# EAGLE design urbieBoard (EAGLE 7.1.0)
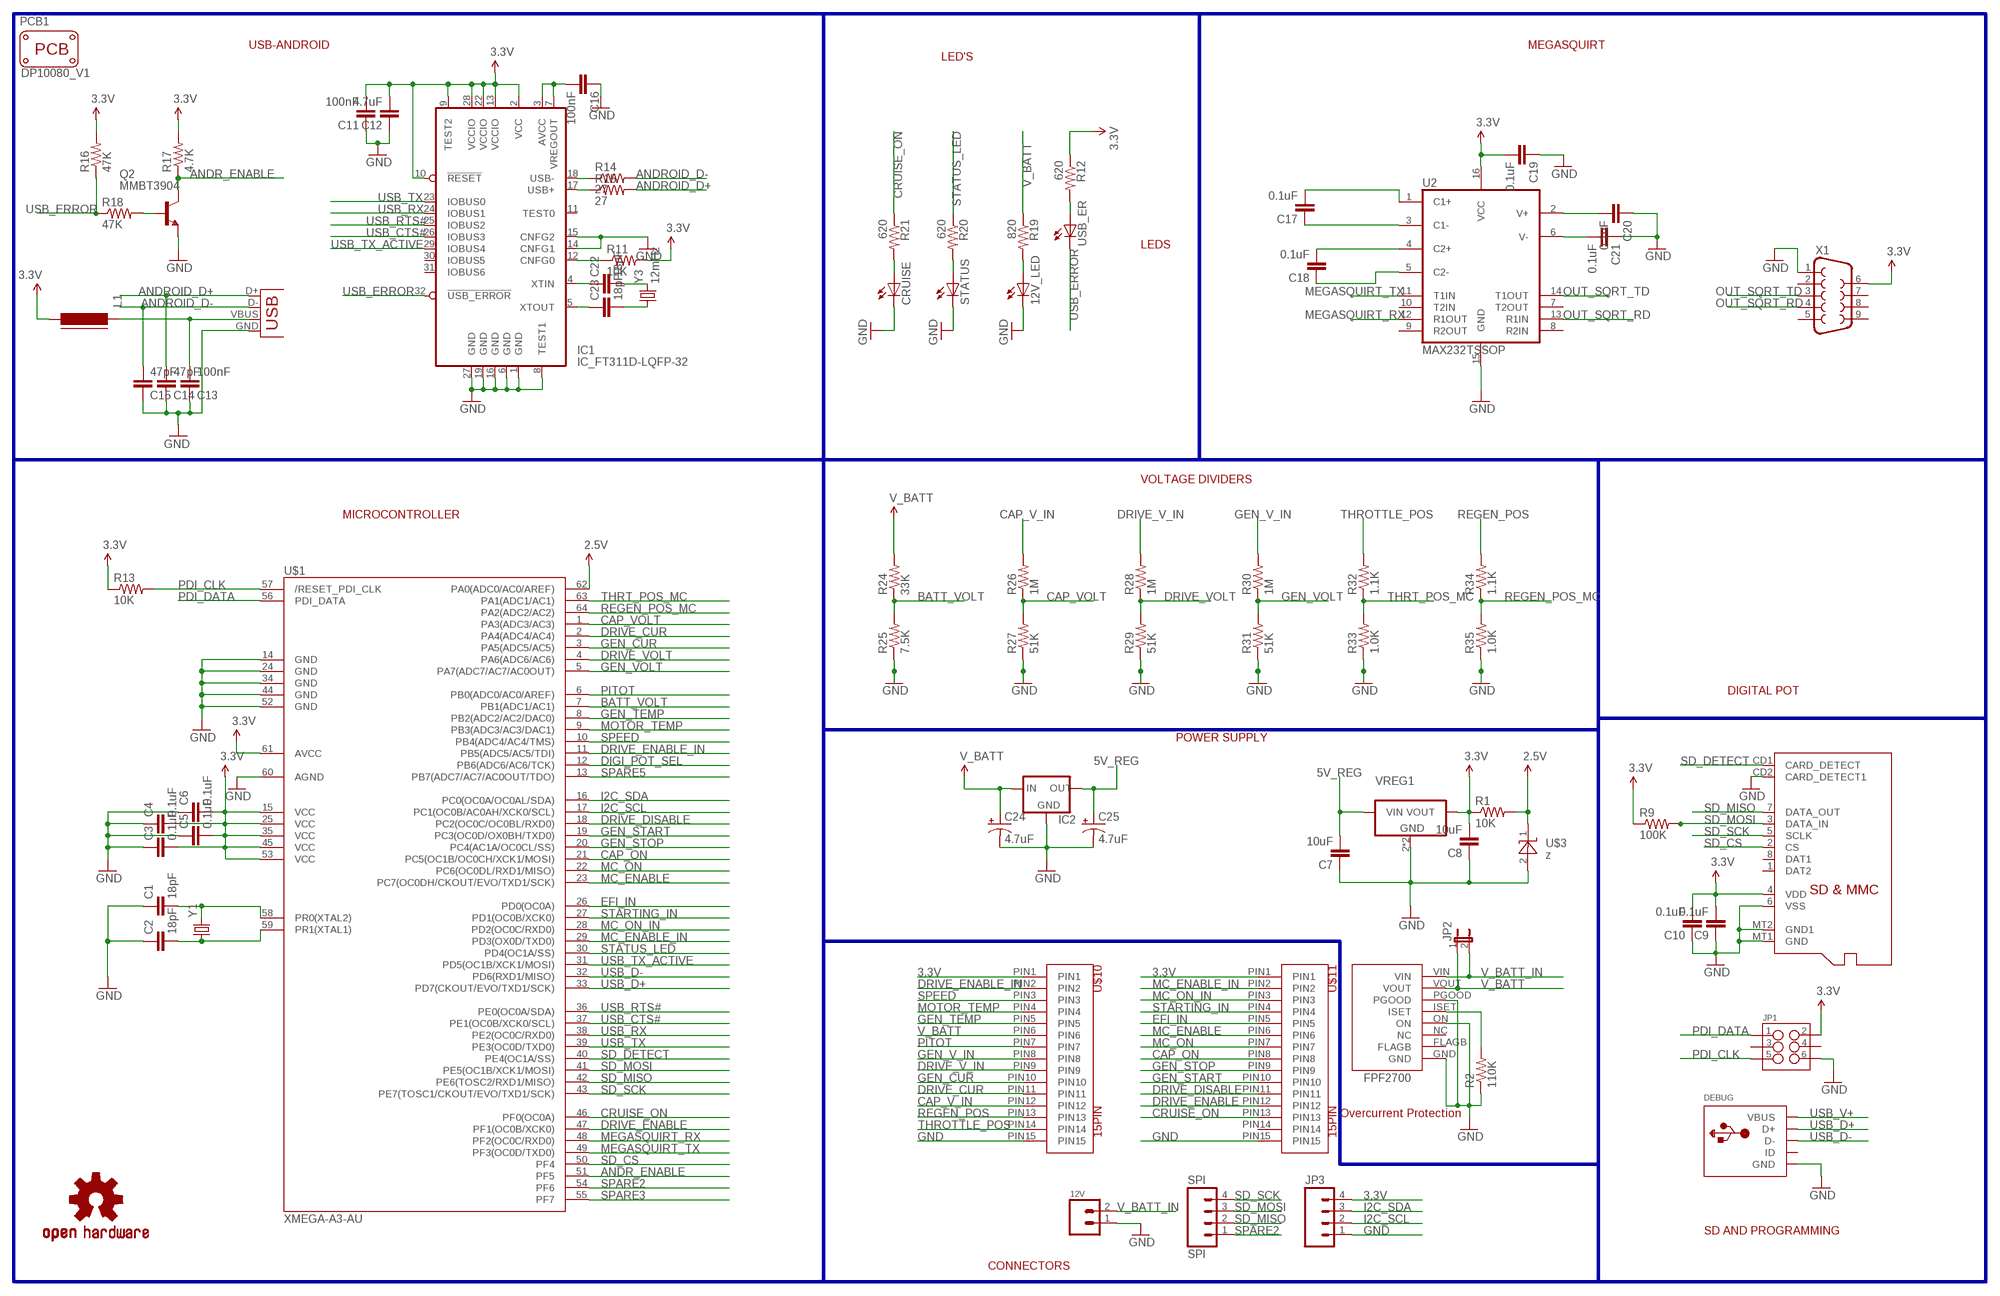
[diagram p0: schematic, sheet 1]

## Parts
12V  DURACLIK-2SMD  [DURACLIK-2]
12V_LED  LEDCHIP-LED0603  [CHIP-LED0603]
C1  18pF  CAP0603-CAP  [0603-CAP]
C2  18pF  CAP0603-CAP  [0603-CAP]
C3  0.1uF  CAP0603-CAP  [0603-CAP]
C4  0.1uF  CAP0603-CAP  [0603-CAP]
C5  0.1uF  CAP0603-CAP  [0603-CAP]
C6  0.1uF  CAP0603-CAP  [0603-CAP]
C7  10uF  CAP0603-CAP  [0603-CAP]
C8  10uF  CAP0603-CAP  [0603-CAP]
C9  0.1uF  CAP0603-CAP  [0603-CAP]
C10  0.1uF  CAP0603-CAP  [0603-CAP]
C11  100nF  CAP0603-CAP  [0603-CAP]
C12  4.7uF  CAP0603-CAP  [0603-CAP]
C13  100nF  CAP0603-CAP  [0603-CAP]
C14  47pF  CAP0603-CAP  [0603-CAP]
C15  47pF  CAP0603-CAP  [0603-CAP]
C16  100nF  CAP0603-CAP  [0603-CAP]
C17  0.1uF  CAP0603-CAP  [0603-CAP]
C18  0.1uF  CAP0603-CAP  [0603-CAP]
C19  0.1uF  CAP0603-CAP  [0603-CAP]
C20  0.1uF  CAP0603-CAP  [0603-CAP]
C21  0.1uF  CAP0603-CAP  [0603-CAP]
C22  18pF  CAP0603-CAP  [0603-CAP]
C23  18pF  CAP0603-CAP  [0603-CAP]
C24  4.7uF  CAP_POLPTH2  [CPOL-RADIAL-10UF-25V]
C25  4.7uF  CAP_POLPTH2  [CPOL-RADIAL-10UF-25V]
CRUISE  LEDCHIP-LED0603  [CHIP-LED0603]
DEBUG  USBMINIB  [USB-MINIB]
IC1  IC_FT311D-LQFP-32  [LQFP-32]
IC2  V_REG_78XXSINK  [TO220-IGO]
JP1  M03X22X3_SILK_SM  [2X3]
JP2  JP1E  [JP1]
JP3  M04POLAR_LOCK  [MOLEX-1X4_LOCK]
JP4  USB-A-S  [USB-A-S]
L1  FERRITE-0805  [FB805]
LOGO1  OSHW-LOGOM  [OSHW-LOGO-M]
PCB1  PCB_DP_RECTANGLE-80X100  [DP10080_V1]
Q2  MMBT3904  BCX20SMD  [SOT23-BEC]
R1  10K  RESISTOR0603-RES  [0603-RES]
R2  110K  RESISTOR0603-RES  [0603-RES]
R9  100K  RESISTOR0603-RES  [0603-RES]
R11  10K  RESISTOR0603-RES  [0603-RES]
R12  620  RESISTOR0603-RES  [0603-RES]
R13  10K  RESISTOR0603-RES  [0603-RES]
R14  27  RESISTOR0603-RES  [0603-RES]
R15  27  RESISTOR0603-RES  [0603-RES]
R16  47K  RESISTOR0603-RES  [0603-RES]
R17  4.7K  RESISTOR0603-RES  [0603-RES]
R18  47K  RESISTOR0603-RES  [0603-RES]
R19  820  RESISTOR0603-RES  [0603-RES]
R20  620  RESISTOR0603-RES  [0603-RES]
R21  620  RESISTOR0603-RES  [0603-RES]
R24  33K  RESISTOR0603-RES  [0603-RES]
R25  7.5K  RESISTOR0603-RES  [0603-RES]
R26  1M  RESISTOR0603-RES  [0603-RES]
R27  51K  RESISTOR0603-RES  [0603-RES]
R28  1M  RESISTOR0603-RES  [0603-RES]
R29  51K  RESISTOR0603-RES  [0603-RES]
R30  1M  RESISTOR0603-RES  [0603-RES]
R31  51K  RESISTOR0603-RES  [0603-RES]
R32  1.1K  RESISTOR0603-RES  [0603-RES]
R33  1.0K  RESISTOR0603-RES  [0603-RES]
R34  1.1K  RESISTOR0603-RES  [0603-RES]
R35  1.0K  RESISTOR0603-RES  [0603-RES]
SPI  SPI  M04POLAR_LOCK  [MOLEX-1X4_LOCK]
STATUS  LEDCHIP-LED0603  [CHIP-LED0603]
U2  MAX232TSSOP  [TSSOP16]
U$1  XMEGA-A3-AU  [TQFP64_14X14MM]
U$2  MICROSD  [MICROSD]
U$3  z  LM4040CYM3-2.5  [SOT-23]
U$8  FPF2700  [FPF2700]
U$10  15PIN  [15PIN]
U$11  15PIN  [15PIN]
USB_ER  LEDCHIP-LED0603  [CHIP-LED0603]
VREG1  VREG_3PINS-SOT-223  [SOT-223]
X1  DB9MALE  [DB9_MALE]
Y1  CRYSTALTXC-7A  [CRYSTAL-TXC-7A]
Y3  12mHz  CRYSTALTXC-7A  [CRYSTAL-TXC-7A]

## Nets
2.8V: R1.2 U$1.62(PA0(ADC0/AC0/AREF)) U$3.1(C) ; supply symbol labelled 2.5V
3.3V: C3.2 C4.2 C5.2 C6.2 C8.2 C9.2 C10.2 C11.2 C12.2 C19.2 IC1.2(VCC) IC1.9(TEST2) IC1.10(!RESET) IC1.13(VCCIO) IC1.22(VCCIO) IC1.28(VCCIO) JP1.2 JP3.4 L1.2 R1.1 R9.1 R11.2 R12.1 R13.1 R16.2 R17.2 U2.16(VCC) U$1.15(VCC1) U$1.25(VCC2) U$1.35(VCC3) U$1.45(VCC4) U$1.53(VCC5) U$1.61(AVCC) U$2.4(VDD) U$10.PIN1 U$11.PIN1 VREG1.3(VOUT) X1.6
5V_REG: C7.2 C25.1(+) IC2.OUT VREG1.1(VIN)
ANDR_ENABLE: Q2.C R17.1 U$1.51(PF5)
ANDROID_D+: C14.2 JP4.D+ R15.2
ANDROID_D-: C15.2 JP4.D- R14.2
BATT_VOLT: R24.1 R25.2 U$1.7(PB1(ADC1/AC1))
CAP_ON: U$1.21(PC5(OC1B/OC0CH/XCK1/MOSI)) U$11.PIN8
CAP_V_IN: R26.2 U$10.PIN12
CAP_VOLT: R26.1 R27.2 U$1.1(PA3(ADC3/AC3))
CRUISE_ON: R21.1 U$1.46(PF0(OC0A)) U$11.PIN13
DIGI_POT_SEL: U$1.12(PB6(ADC6/AC6/TCK))
DRIVE_CUR: U$1.2(PA4(ADC4/AC4)) U$10.PIN11
DRIVE_DISABLE: U$1.18(PC2(OC0C/OC0BL/RXD0)) U$11.PIN11
DRIVE_ENABLE: U$1.47(PF1(OC0B/XCK0)) U$11.PIN12
DRIVE_ENABLE_IN: U$1.11(PB5(ADC5/AC5/TDI)) U$10.PIN2
DRIVE_V_IN: R28.2 U$10.PIN9
DRIVE_VOLT: R28.1 R29.2 U$1.4(PA6(ADC6/AC6))
EFI_IN: U$1.26(PD0(OC0A)) U$11.PIN5
GEN_CUR: U$1.3(PA5(ADC5/AC5)) U$10.PIN10
GEN_START: U$1.19(PC3(OC0D/OX0BH/TXD0)) U$11.PIN10
GEN_STOP: U$1.20(PC4(AC1A/OC0CL/SS)) U$11.PIN9
GEN_TEMP: U$1.8(PB2(ADC2/AC2/DAC0)) U$10.PIN5
GEN_V_IN: R30.2 U$10.PIN8
GEN_VOLT: R30.1 R31.2 U$1.5(PA7(ADC7/AC7/AC0OUT))
GND: 12V.1(PIN1) 12V_LED.C C1.1 C2.1 C3.1 C4.1 C5.1 C6.1 C7.1 C8.1 C9.1 C10.1 C11.1 C12.1 C13.1 C14.1 C15.1 C16.1 C19.1 C20.1 C21.1 C24.2(-) C25.2(-) CRUISE.C DEBUG.GND IC1.1(GND) IC1.6(GND) IC1.8(TEST1) IC1.14(CNFG1) IC1.15(CNFG2) IC1.16(GND) IC1.19(GND) IC1.27(GND) IC2.GND JP1.6 JP3.1 JP4.GND Q2.E R2.1 R25.1 R27.1 R29.1 R31.1 R33.1 R35.1 STATUS.C U2.15(GND) U$1.14(GND1) U$1.24(GND2) U$1.34(GND3) U$1.44(GND4) U$1.52(GND5) U$1.60(AGND) U$2.6(VSS) U$2.CD2(CARD_DETECT1) U$2.MT1(GND) U$2.MT2(GND1) U$3.2(A) U$8.GND U$8.ON U$8.PGOOD U$10.PIN15 U$11.PIN15 VREG1.2(GND) VREG1.4(GND) X1.1
I2C_SCL: JP3.2 U$1.17(PC1(OC0B/AC0AH/XCK0/SCL))
I2C_SDA: JP3.3 U$1.16(PC0(OC0A/OC0AL/SDA))
MC_ENABLE: U$1.23(PC7(OC0DH/CKOUT/EVO/TXD1/SCK)) U$11.PIN6
MC_ENABLE_IN: U$1.29(PD3(OX0D/TXD0)) U$11.PIN2
MC_ON: U$1.22(PC6(OC0DL/RXD1/MISO)) U$11.PIN7
MC_ON_IN: U$1.28(PD2(OC0C/RXD0)) U$11.PIN3
MEGASQUIRT_RX: U2.12(R1OUT) U$1.48(PF2(OC0C/RXD0))
MEGASQUIRT_TX: U2.11(T1IN) U$1.49(PF3(OC0D/TXD0))
MOTOR_TEMP: U$1.9(PB3(ADC3/AC3/DAC1)) U$10.PIN4
N$1: C1.2 U$1.58(PR0(XTAL2)) Y1.P$2
N$2: C2.2 U$1.59(PR1(XTAL1)) Y1.P$1
N$8: C22.1 IC1.4(XTIN)
N$9: C23.1 IC1.5(XTOUT)
N$10: R2.2 U$8.ISET
N$11: IC1.12(CNFG0) R11.1
N$12: C22.2 Y3.P$2
N$13: C23.2 Y3.P$1
N$15: IC1.18(USB-) R14.1
N$18: C17.2 U2.1(C1+)
N$19: IC1.17(USB+) R15.1
N$20: C16.2 IC1.3(AVCC) IC1.7(VREGOUT)
N$23: Q2.B R18.2
N$24: C13.2 JP4.VBUS L1.1
N$25: C17.1 U2.3(C1-)
N$26: C18.2 U2.4(C2+)
N$27: C18.1 U2.5(C2-)
N$28: C21.2 U2.6(V-)
N$29: C20.2 U2.2(V+)
N$30: R12.2 USB_ER.A
N$31: 12V_LED.A R19.2
N$33: CRUISE.A R21.2
N$35: R20.2 STATUS.A
OUT_SQRT_RD: U2.13(R1IN) X1.4
OUT_SQRT_TD: U2.14(T1OUT) X1.3
PDI_CLK: JP1.5 R13.2 U$1.57(/RESET_PDI_CLK)
PDI_DATA: JP1.1 U$1.56(PDI_DATA)
PITOT: U$1.6(PB0(ADC0/AC0/AREF)) U$10.PIN7
REGEN_POS: R34.2 U$10.PIN13
REGEN_POS_MC: R34.1 R35.2 U$1.64(PA2(ADC2/AC2))
SD_CS: U$1.50(PF4) U$2.2(CS)
SD_DETECT: U$1.40(PE4(OC1A/SS)) U$2.CD1(CARD_DETECT)
SD_MISO: SPI.2 U$1.42(PE6(TOSC2/RXD1/MISO)) U$2.7(DATA_OUT)
SD_MOSI: R9.2 SPI.3 U$1.41(PE5(OC1B/XCK1/MOSI)) U$2.3(DATA_IN)
SD_SCK: SPI.4 U$1.43(PE7(TOSC1/CKOUT/EVO/TXD1/SCK)) U$2.5(SCLK)
SPARE2: SPI.1 U$1.54(PF6)
SPARE3: U$1.55(PF7)
SPARE5: U$1.13(PB7(ADC7/AC7/AC0OUT/TDO))
SPEED: U$1.10(PB4(ADC4/AC4/TMS)) U$10.PIN3
STARTING_IN: U$1.27(PD1(OC0B/XCK0)) U$11.PIN4
STATUS_LED: R20.1 U$1.30(PD4(OC1A/SS))
THROTTLE_POS: R32.2 U$10.PIN14
THRT_POS_MC: R32.1 R33.2 U$1.63(PA1(ADC1/AC1))
USB_CTS#: IC1.26(IOBUS3) U$1.37(PE1(OC0B/XCK0/SCL))
USB_D+: DEBUG.D+ U$1.33(PD7(CKOUT/EVO/TXD1/SCK))
USB_D-: DEBUG.D- U$1.32(PD6(RXD1/MISO))
USB_ERROR: IC1.32(!USB_ERROR) R16.1 R18.1 USB_ER.C
USB_RTS#: IC1.25(IOBUS2) U$1.36(PE0(OC0A/SDA))
USB_RX: IC1.24(IOBUS1) U$1.38(PE2(OC0C/RXD0))
USB_TX: IC1.23(IOBUS0) U$1.39(PE3(OC0D/TXD0))
USB_TX_ACTIVE: IC1.29(IOBUS4) U$1.31(PD5(OC1B/XCK1/MOSI))
USB_V+: DEBUG.VBUS
V_BATT: C24.1(+) IC2.IN JP2.1 R19.1 R24.2 U$8.VOUT U$10.PIN6
V_BATT_IN: 12V.2(PIN2) JP2.2 U$8.VIN
Unconnected: DEBUG.ID IC1.11(TEST0) IC1.30(IOBUS5) IC1.31(IOBUS6) JP1.3 JP1.4 U2.7(T2OUT) U2.8(R2IN) U2.9(R2OUT) U2.10(T2IN) U$2.1(DAT2) U$2.8(DAT1) U$8.FLAGB U$8.NC U$11.PIN14 X1.2 X1.5 X1.7 X1.8 X1.9

## Buses
B$1

## Notes on the sheet
- USB-ANDROID | MEGASQUIRT
- LED'S
- LEDS
- VOLTAGE DIVIDERS
- MICROCONTROLLER
- DIGITAL POT
- POWER SUPPLY
- Overcurrent Protection
- SD AND PROGRAMMING
- CONNECTORS

## Library data of the parts
12V = Senior Design:DURACLIK-2: Device for 2 circuit Molex DuraClik 2.00mm Pitch Wire-to-Board Connector System; OC_NEWARK: unknown
12V_LED CRUISE STATUS USB_ER = adafruit:LED: LED OSRAM: - CHIPLED LG R971, LG N971, LY N971, LG Q971, LY Q971, LO R971, LY R971 LH N974, LH R974 LS Q976, LO Q976, LY Q976 LO Q996 - Hyper CHIPLED LW Q18S LB Q993, LB Q99A, LB R99A - SideLED LS A670, LO A670, LY A670, LG A670, LP A670 LB A673, LV A673, LT A673, LW A673 LH A674 LY A675 LS A676, LA A676, LO A676, LY A676, LW A676 LS A679, LY A679, LG A679 - Hyper Micro SIDELED® LS Y876, LA Y876, LO Y876, LY Y876 LT Y87S - SmartLED LW L88C, LW L88S LB L89C, LB L89S, LG L890 LS L89K, LO L89K, LY L89K LS L896, LA L896, LO L896, LY L896 - TOPLED LS T670, LO T670, LY T670, LG T670, LP T670 LSG T670, LSP T670, LSY T670, LOP T670, LYG T670 LG T671, LOG T671, LSG T671 LB T673, LV T673, LT T673, LW T673 LH T674 LS T676, LA T676, LO T676, LY T676, LB T676, LH T676, LSB T676, LW T676 LB T67C, LV T67C, LT T67C, LS T67K, LO T67K, LY T67K, LW E67C LS E67B, LA E67B, LO E67B, LY E67B, LB E67C, LV E67C, LT E67C LW T67C LS T679, LY T679, LG T679 LS T770, LO T770, LY T770, LG T770, LP T770 LB T773, LV T773, LT T773, LW T773 LH T774 LS E675, LA E675, LY E675, LS T675 LS T776, LA T776, LO T776, LY T776, LB T776 LHGB T686 LT T68C, LB T68C - Hyper Mini TOPLED® LB M676 - Mini TOPLED Santana® LG M470 LS M47K, LO M47K, LY M47K Source: http://www.osram.convergy.de/; OC_NEWARK: unknown
C1 C2 C22 C23 = SparkFun-Capacitors:CAP: Capacitor Standard 0603 ceramic capacitor, and 0.1" leaded capacitor.; MPN: 06031A180JAT2A; OC_NEWARK: 60R6182
C3-C21 = SparkFun-Capacitors:CAP: Capacitor Standard 0603 ceramic capacitor, and 0.1" leaded capacitor.; OC_NEWARK: unknown
C24 C25 = SparkFun-Passives:CAP_POL: Capacitor Polarized These are standard SMD and PTH capacitors. Normally 10uF, 47uF, and 100uF in electrolytic and tantalum varieties. Always verify the external diameter of the through hole cap, it varies with capacity, voltage, and manufacturer. The EIA devices should be standard.; OC_NEWARK: unknown
DEBUG = adafruit:USB: USB Connectors USBMINIB - Surface Mount Female Mini-B USB Connector 4UConnector: 06564 By microbuilder.eu Thru-hole RA Female Mini-B USB Connector 4UConnector: 18732 By ladyada.net; OC_NEWARK: unknown
IC1 = dp_devices:IC_FT311D: USB Android Host Mfr no: FT311D-32L1C FT311D <http://www.ftdichip.com/Support/Documents/DataSheets/ICs/DS_FT311D.pdf>; OC_NEWARK: unknown
IC2 = SparkFun-PowerIC:V_REG_78XX: Voltage Regulator Standard 7805 5V regulator. IGO (Input Ground Output). Spark Fun Electronics SKU : COM-00107; OC_NEWARK: unknown
JP1 = SparkFun-Connectors:M03X2: 2x3 .1" header. Shrouded, with keying- CONN-10681 SMT- CONN-11415 Pogo pins- HW-11044; OC_NEWARK: unknown
JP2 = jumper:JP1E: JUMPER; OC_NEWARK: unknown
JP3 SPI = SparkFun-Connectors:M04: Header 4 Standard 4-pin 0.1" header. Use with straight break away headers (SKU : PRT-00116), right angle break away headers (PRT-00553), swiss pins (PRT-00743), machine pins (PRT-00117), and female headers (PRT-00115). Molex polarized connector foot print use with SKU : PRT-08231 with associated crimp pins and housings. 1MM SMD Version SKU: PRT-10208; OC_NEWARK: unknown
JP4 = SparkFun-Connectors:USB: USB Connectors USB-B-PTH is fully proven SKU : PRT-00139/CONN-08278 USB-miniB is fully proven SKU : PRT-00587 USB-A-PCB is untested. USB-A-H is throughly reviewed, but untested. Spark Fun Electronics SKU : PRT-00437 USB-B-SMT is throughly reviewed, but untested. Needs silkscreen touching up. USB-A-S has not been used/tested USB-MB-H has not been used/tested USB-MICROB has been used. CONN-09505
L1 = dp_devices:FERRITE: Ferrite bead in various packages; OC_NEWARK: unknown
LOGO1 = SparkFun-Aesthetics:OSHW-LOGO: Open Source Hardware Logo This logo indicates the piece of hardware it is found on incorporates a OSHW license and/or adheres to the definition of open source hardware found here: http://freedomdefined.org/OSHW; OC_NEWARK: unknown
PCB1 = dp_devices:PCB_DP_RECTANGLE: Dangerous Prototypes Standard Rectangular PCB sizes; OC_NEWARK: unknown; PCB_SIZE: DP10080_V1
Q2 = transistor-npn:BCX20*: NPN Transistor; OC_NEWARK: unknown
R1 R2 R9 R11-R21 R24-R35 = SparkFun-Passives:RESISTOR: Resistor Basic schematic elements and footprints for 0603, 1206, and PTH resistors.; OC_NEWARK: unknown
U2 = SparkFun-DigitalIC:MAX232: RS232 Transceiver Very common IC. This is generically called 'MAX232', but works with the 3V equivalent MAX3232 generic ICs. Field tested and mother approved. Spark Fun Electronics SKU : COM-00316 (DIP) and COM-00589 (SMD); OC_NEWARK: unknown
U$1 = SparkFun-DigitalIC:XMEGA-A3: Atmel's 8/16-bit AVR XMEGA A3 Microcontroller - ATxmega256A3, etc.; OC_NEWARK: unknown
U$2 = adafruit:MICROSD: Micro-SD / Transflash card holder with SPI pinout For the 3M # 2908-05WB-MG and/or 4UCON #19656 push-push type; OC_NEWARK: unknown
U$3 = GuShH:LM4040; OC_NEWARK: unknown
U$8 = FPF2700:FPF2700; OC_NEWARK: unknown
U$10 U$11 = 15pinconn:15PIN
VREG1 = dp_devices:VREG_3PINS: Various 3 pin voltage regulators in different packages Double check the right pinout for the right part; OC_NEWARK: unknown
X1 = SparkFun-Connectors:DB9: DB9 Connector Standard DB9 (D-Sub 9) serial connector. Can be used for CAN bus as well as RS485 and RS232. Footprint production proven. Spark Fun Electronics SKU : PRT-00429; OC_NEWARK: unknown
Y1 Y3 = SparkFun-FreqCtrl:CRYSTAL: Various standard crystals. Proven footprints. Spark Fun Electronics SKU : COM-00534; OC_NEWARK: unknown

## Board
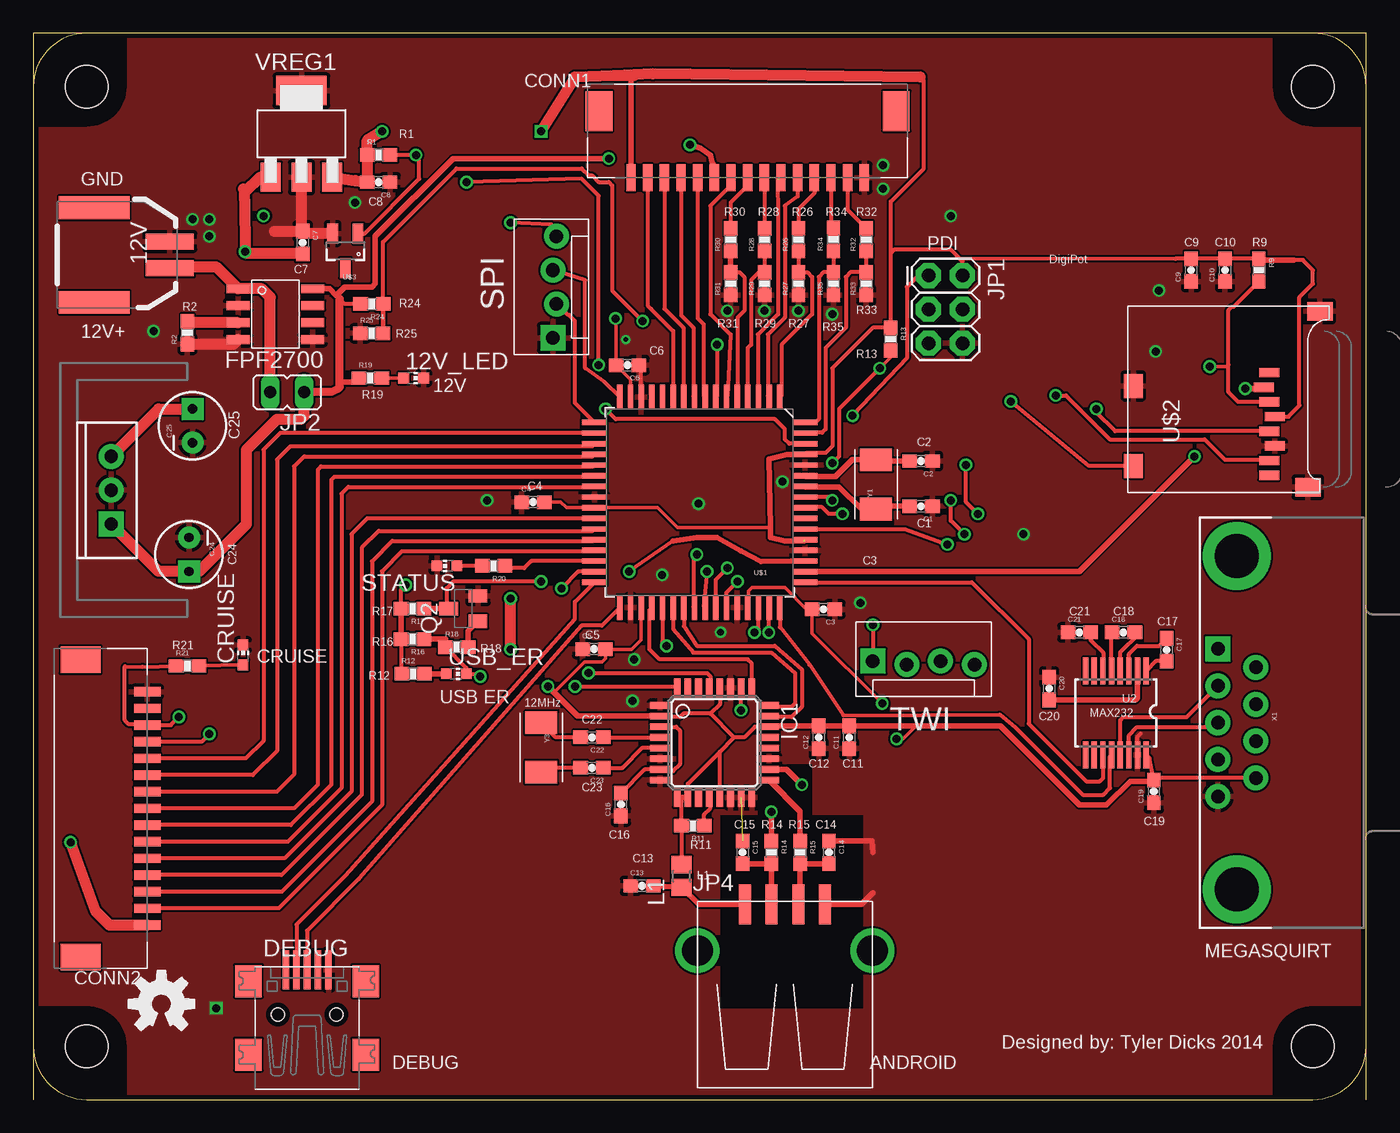
[diagram p1: board, top side]
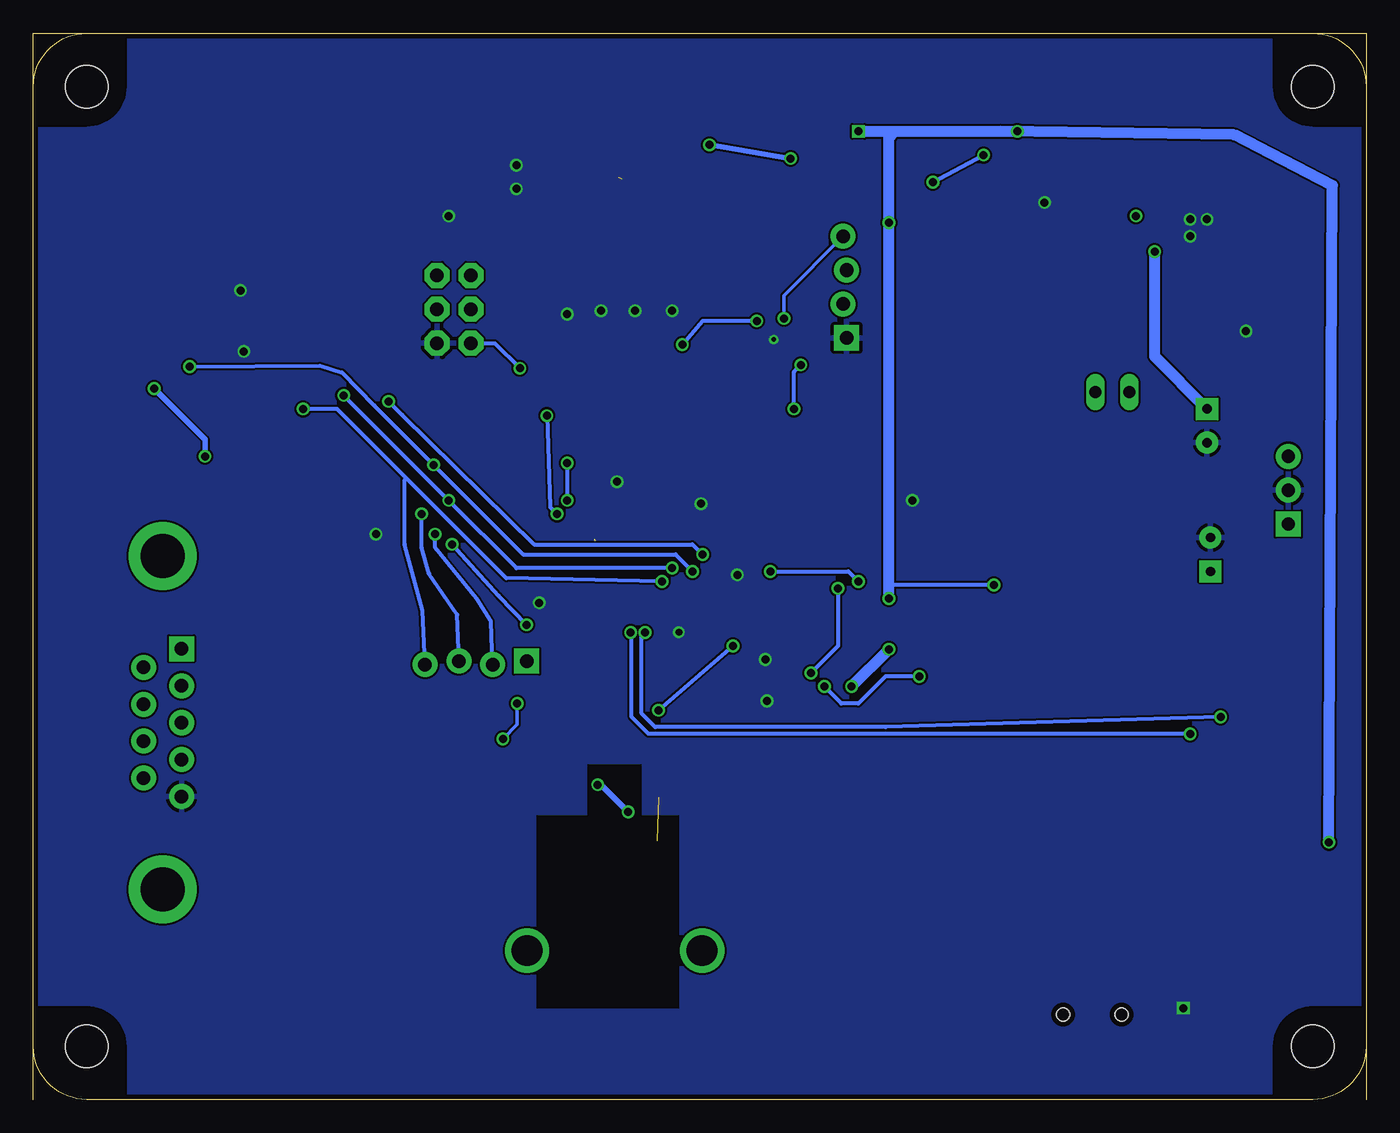
[diagram p2: board, bottom side, seen from below]

Size 100 x 80 mm. Coordinates in mm from the lower left corner, seen from the top.
Outline: 100,0 100,80 0,80 0,0
Copper layers (1*16): Top 0.035mm / dielectric 1.5mm / Bottom 0.035mm
Design rules "default *": minimum track width 6mil, minimum drill 13mil, track to track 6mil, track to pad 6mil, pad to pad 6mil, via to via 6mil, smd to smd 6mil, copper to edge 15mil, drill to drill 6mil, minimum pad ring 7mil, minimum via ring 7mil, stop-mask expansion 3mil, vias tented up to drill 24mil, thermal gap 10mil
tRestrict: area 51.6,6.9 to 62.2,21.3; area 54.4,21.3 to 58.4,25.1
bRestrict: area 51.6,6.9 to 62.2,21.3; area 54.4,21.3 to 58.4,25.1

### Footprints (pad centres in the part's own frame; a part is rotated, then mirrored left to right if it is on the bottom)
DURACLIK-2 = smd 1.2 x 3.6: 1 -1,3.465; 2 1,3.465 | smd 1.7 x 5.3: P$3 -3.55,-2.215; P$4 3.55,-2.215
CHIP-LED0603 = smd 0.8 x 0.8: A 0,-0.75; C 0,0.75
0603-CAP = smd 1.1 x 1: 1 -0.85,0; 2 0.85,0
CPOL-RADIAL-10UF-25V = drill 0.7 pad 1.651 square: 1 1.27,0 | drill 0.7 pad 1.651: 2 -1.27,0
USB-MINIB = smd 0.5 x 2.908: D+ 0,4.364; D- -0.8,4.364; GND 1.6,4.364; ID 0.8,4.364; VBUS -1.6,4.364 | smd 2 x 2.4: GND1 -4.4,-2; GND2 -4.4,3.5; GND3 4.4,3.5; GND4 4.4,-2 | hole 1: -2.2,1; 2.2,1
LQFP-32 = smd 0.5 x 1.45: 1 -2.8,-4.1; 2 -2,-4.1; 3 -1.2,-4.1; 4 -0.4,-4.1; 5 0.4,-4.1; 6 1.2,-4.1; 7 2,-4.1; 8 2.8,-4.1; 17 2.8,4.1; 18 2,4.1; 19 1.2,4.1; 20 0.4,4.1; 21 -0.4,4.1; 22 -1.2,4.1; 23 -2,4.1; 24 -2.8,4.1 | smd 1.45 x 0.5: 9 4.1,-2.8; 10 4.1,-2; 11 4.1,-1.2; 12 4.1,-0.4; 13 4.1,0.4; 14 4.1,1.2; 15 4.1,2; 16 4.1,2.8; 25 -4.1,2.8; 26 -4.1,2; 27 -4.1,1.2; 28 -4.1,0.4; 29 -4.1,-0.4; 30 -4.1,-1.2; 31 -4.1,-2; 32 -4.1,-2.8
TO220-IGO = drill 1 pad 1.88: GND 0,0; OUT 2.54,0 | drill 1 pad 1.88 square: IN -2.54,0
2X3 = drill 1.016 pad 1.88 octagon: 1 0,0; 2 0,2.54; 3 2.54,0; 4 2.54,2.54; 5 5.08,0; 6 5.08,2.54
JP1 = drill 0.914 long: 1 0,-1.27; 2 0,1.27
MOLEX-1X4_LOCK = drill 1.016 pad 1.88 square: 1 0,0.127 | drill 1.016 pad 1.88: 2 2.54,-0.127; 3 5.08,0.127; 4 7.62,-0.127
USB-A-S = smd 3 x 0.9: D+ 3.45,-1; D- 3.45,1; GND 3.45,-3; VBUS 3.45,3 | drill 2.311: P$5 0,-6.566; P$6 0,6.566
FB805 = smd 1.3 x 1.5: 1 -0.85,0; 2 0.85,0
DP10080_V1 = hole 3.2: -46,-36; 46,-36; 46,36; -46,36
SOT23-BEC = smd 1 x 1.4: B -0.95,-1.1; C 0,1.1; E 0.95,-1.1
0603-RES = smd 1.1 x 1: 1 -0.85,0; 2 0.85,0
TSSOP16 = smd 0.4 x 2: 1 -2.225,-3.05; 2 -1.575,-3.05; 3 -0.925,-3.05; 4 -0.275,-3.05; 5 0.375,-3.05; 6 1.025,-3.05; 7 1.675,-3.05; 8 2.325,-3.05; 9 2.325,3.25; 10 1.675,3.25; 11 1.025,3.25; 12 0.375,3.25; 13 -0.275,3.25; 14 -0.925,3.25; 15 -1.575,3.25; 16 -2.225,3.25
TQFP64_14X14MM = smd 0.4 x 1.87: 1 -6,-7.9; 2 -5.2,-7.9; 3 -4.4,-7.9; 4 -3.6,-7.9; 5 -2.8,-7.9; 6 -2,-7.9; 7 -1.2,-7.9; 8 -0.4,-7.9; 9 0.4,-7.9; 10 1.2,-7.9; 11 2,-7.9; 12 2.8,-7.9; 13 3.6,-7.9; 14 4.4,-7.9; 15 5.2,-7.9; 16 6,-7.9; 33 6,7.9; 34 5.2,7.9; 35 4.4,7.9; 36 3.6,7.9; 37 2.8,7.9; 38 2,7.9; 39 1.2,7.9; 40 0.4,7.9; 41 -0.4,7.9; 42 -1.2,7.9; 43 -2,7.9; 44 -2.8,7.9; 45 -3.6,7.9; 46 -4.4,7.9; 47 -5.2,7.9; 48 -6,7.9 | smd 1.87 x 0.4: 17 7.9,-6; 18 7.9,-5.2; 19 7.9,-4.4; 20 7.9,-3.6; 21 7.9,-2.8; 22 7.9,-2; 23 7.9,-1.2; 24 7.9,-0.4; 25 7.9,0.4; 26 7.9,1.2; 27 7.9,2; 28 7.9,2.8; 29 7.9,3.6; 30 7.9,4.4; 31 7.9,5.2; 32 7.9,6; 49 -7.9,6; 50 -7.9,5.2; 51 -7.9,4.4; 52 -7.9,3.6; 53 -7.9,2.8; 54 -7.9,2; 55 -7.9,1.2; 56 -7.9,0.4; 57 -7.9,-0.4; 58 -7.9,-1.2; 59 -7.9,-2; 60 -7.9,-2.8; 61 -7.9,-3.6; 62 -7.9,-4.4; 63 -7.9,-5.2; 64 -7.9,-6
MICROSD = smd 0.7 x 1.5: 1 9,-10.64; 2 7.9,-10.24; 3 6.8,-10.64; 4 5.7,-11.04; 5 4.6,-10.64; 6 3.5,-11.04; 7 2.4,-10.64; 8 1.3,-10.64 | smd 1.8 x 1.4: CD1 2,-0.44; CD2 8,-0.44 | smd 1.4 x 1.9: MT1 0.4,-13.54; MT2 13.6,-14.44
SOT-23 = smd 0.8 x 1.5: 1 -0.95,-1.3; 2 0.95,-1.3; 3 0,1.3
FPF2700 = smd 0.65 x 1.75: FLAGB 0.635,-2.794; GND -1.905,-2.794; ISET -0.635,2.794; NC -0.635,-2.794; ON -1.905,2.794; PGOOD 0.635,2.794; VIN 1.905,2.794; VOUT 1.905,-2.794
15PIN = smd 2 x 3: P$1 -11.15,0; P$2 11.15,0 | smd 0.7 x 2: PIN1 -8.75,-5; PIN2 -7.5,-5; PIN3 -6.25,-5; PIN4 -5,-5; PIN5 -3.75,-5; PIN6 -2.5,-5; PIN7 -1.25,-5; PIN8 0,-5; PIN9 1.25,-5; PIN10 2.5,-5; PIN11 3.75,-5; PIN12 5,-5; PIN13 6.25,-5; PIN14 7.5,-5; PIN15 8.75,-5
SOT-223 = smd 1.5 x 2.2: 1 -2.3,-3.25; 2 0,-3.25; 3 2.3,-3.25 | smd 3.8 x 2.2: 4 0,3.25
DB9_MALE = drill 1.016 pad 1.88: 1 5.54,-1.42; 2 2.77,-1.42; 3 0,-1.42; 4 -2.77,-1.42; 6 4.15,1.42; 7 1.38,1.42; 8 -1.38,1.42; 9 -4.15,1.42 | drill 1.016 pad 1.88 square: 5 -5.54,-1.42 | drill 3.302 pad 5.08: G1 -12.5,0; G2 12.5,0
CRYSTAL-TXC-7A = smd 1.7 x 2.4: P$1 1.85,0; P$2 -1.85,0

### Placement (x,y rotation side)
12V  6.78,63.37 270 top
12V_LED  28.53,54.13 270 top
C1  66.61,44.52 180 top
C2  66.61,47.91 180 top
C3  59.28,36.78 180 top
C4  37.5,44.83 0 top
C5  42.07,33.8 0 top
C6  44.58,55.1 180 top
C7  20.21,64.3 270 top
C8  25.91,68.83 180 top
C9  86.87,62.23 90 top
C10  89.41,62.23 90 top
C11  61.21,27.18 90 top
C12  58.93,27.18 90 top
C13  45.67,16.04 0 top
C14  59.69,18.54 270 top
C15  53.21,18.54 270 top
C16  44.09,22.14 90 top
C17  85.03,33.75 270 top
C18  81.79,35.05 0 top
C19  84.07,23.11 90 top
C20  76.21,30.84 270 top
C21  78.49,35.05 0 top
C22  41.91,27.18 180 top
C23  41.91,24.89 180 top
C24  11.68,40.89 270 top
C25  11.94,50.55 90 top
CRUISE  15.73,33.35 0 top
DEBUG  20.54,5.37 0 top
IC1  51.1,26.77 270 top
IC2  5.84,45.72 90 top
JP1  67.17,61.83 270 top
JP2  19.05,53.09 90 top
JP3  39.12,57.15 90 top
JP4  56.39,11.18 90 top
L1  48.64,16.76 90 top
LOGO1  9.61,7.17 0 top
PCB1  50,40 0 top
Q2  32.26,36.83 90 top
R1  25.91,70.87 0 top
R2  11.56,57.53 90 top
R9  91.95,62.23 270 top
R11  49.48,20.54 180 top
R12  28.49,31.94 0 top
R13  64.33,57.06 270 top
R14  55.37,18.54 270 top
R15  57.53,18.54 270 top
R16  28.45,34.54 180 top
R17  28.45,36.83 180 top
R18  31.77,33.95 0 top
R19  25.28,54.13 0 top
R20  34.54,40.04 180 top
R21  11.56,32.53 0 top
R24  25.4,59.69 180 top
R25  25.39,57.49 0 top
R26  57.4,64.52 90 top
R27  57.4,61.21 90 top
R28  54.86,64.52 90 top
R29  54.86,61.21 90 top
R30  52.32,64.52 90 top
R31  52.32,61.21 90 top
R32  62.48,64.52 90 top
R33  62.48,61.21 90 top
R34  60.03,64.53 90 top
R35  60.03,61.22 90 top
SPI  62.99,32.77 0 top
STATUS  31.04,40.04 90 top
U2  81.27,29.11 180 top
U$1  50,44.8 180 top
U$2  82.09,45.54 90 top
U$3  23.41,63.68 180 top
U$4  [SHELL]  30.23,11.68 0 top
U$5  [SEM]  29.72,6.6 0 top
U$6  [CU-PILLAR]  64.77,7.62 0 top
U$8  18.16,58.93 90 top
U$10  53.59,74.17 0 top
U$11  3.56,21.84 90 top
USB_ER  31.73,31.94 270 top
VREG1  20.12,72.45 0 top
X1  90.3,28.28 270 top
Y1  63.23,46.15 90 top
Y3  38.1,26.42 270 top

### Tracks (layer width: path | path; a pad name or v marks a point on that pad's centre or on a via)
2.8V  (via drill 0.6)
  Top 0.305: U$3.1 24.85,64.98 28.96,69.09 28.96,70.87 v28.7,70.87 R1.2 | U$1.62 56.72,49.2 56.39,49.53 56.39,50.29 55.63,51.05 43.69,51.05 v42.93,51.82 | v42.42,55.12 42.42,67.82 41.15,69.09 v32.51,68.83
  Bottom 0.305: v42.93,51.82 42.93,54.61 v42.42,55.12 | v32.51,68.83 v28.7,70.87
3.3V  (via drill 0.6, 0.6 pad 0.25)  (1 unrouted)
  Top 0.254: U$1.15 44.8,54.02 C6.2 43.73,58.57 v43.69,58.61 | 55.29,42.94 55.28,42.93 48.32,42.93 46.85,44.4 U$1.25 39.99,44.4 39.56,44.83 C4.2 | v63.69,29.72 58.43,34.98 C3.2 58.02,36.78 56.39,38.42 53.91,38.42 53.66,38.16 53.66,36.96 U$1.45 | v64.77,27.05 65.25,27.05 66.23,28.03 | U$1.35 45.6,34.49 44.9,33.78 42.94,33.78 C5.2 42.92,33.08 42.67,32.83 41.34,32.83 39.05,30.54 | 85.69,63.08 69.51,63.08 69.28,63.31
  Top 0.305: 64.33,63.5 R13.1 62.99,57.91 59.94,54.86 59.94,49.02 59.44,48.51 58.01,48.51 U$1.61 | 64.33,63.5 64.33,67.37 66.8,69.85 66.8,76.45 66.55,76.71 | JP1.2 69.71,62.88 69.28,63.31 68.83,63.75 64.58,63.75 64.33,63.5 | U2.16 83.73,25.62 C19.2 84.49,24.13 X1.6 | U$2.4 94.17,51.24 95,52.07 95,60.2 96.01,61.21 96.01,62.23 95.25,62.99 94.58,62.99 | R9.1 C10.2 C9.2 85.69,63.08 | R17.2 27.6,38.27 v27.94,38.61 | R16.2 27.6,31.98 R12.1 | IC1.28 51.5,29.66 50.8,28.96 | 50.8,28.96 48.77,28.96 48.51,28.7 47.06,28.7 IC1.2 | IC1.22 54.13,27.97 53.34,27.18 52.58,27.18 | 52.58,27.18 50.8,28.96 | IC1.13 51.5,26.1 | 51.5,26.1 52.58,27.18 | IC1.10 49.1,23.7 51.5,26.1 | IC1.9 48.63,22.33 R11.2 48.63,18.64 L1.2 | JP3.4 38.86,65.66 v35.81,65.79
  Top 0.406: IC1.9 IC1.10 | R16.2 R17.2 | IC1.22 55.26,28.03 C12.2 C11.2 66.23,28.03 72.56,28.03 78.49,22.1 80.52,22.1 82.3,23.88 83.99,23.88 C19.2 | IC1.2 40.83,28.77 39.05,30.54 v38.61,30.99 | 94.58,62.99 91.95,62.99 R9.1 | U$1.61 56.53,48.4 55.18,48.07 55.29,42.94 55.31,42.16 56.39,41.91 57.81,41.91 | U$10.PIN1 44.84,76.71 44.96,76.82
  Top 0.813: VREG1.3 24.16,68.95 C8.2 R1.1 25.06,71.97 v26.16,72.64 | 45.1,76.82 44.96,76.82 43.56,76.83 | 43.56,76.83 40.64,76.71 v38.1,72.64 | v2.79,19.3 4.69,14.11 5.7,13.09 U$11.PIN1 | 66.55,76.71 46.48,76.96 43.56,76.83 | v35.81,33.78 v35.81,37.59
  Bottom 0.254: v43.69,58.61 43.69,60.33 JP3.4 | v63.69,29.72 63.69,28.13 v64.77,27.05
  Bottom 0.305: v27.94,38.61 35.81,38.61
  Bottom 0.813: v2.79,19.3 2.54,68.58 9.91,72.39 27.43,72.64 | v38.61,30.99 v35.81,33.78 | v35.81,37.59 35.81,38.61 v35.81,65.79 35.81,72.14 35.31,72.64 | 35.31,72.64 27.43,72.64 | v38.1,72.64 35.31,72.64 | 27.43,72.64 v26.16,72.64
5V_REG  (via drill 0.6)
  Top 0.813: C7.2 20.17,63.5 16,63.5 v15.88,63.63 15.87,67.44 15.87,68.07 | IC2.OUT 9.4,51.82 C25.1 | 15.87,68.07 15.87,68.22 15.75,68.34 | VREG1.1 17,69.2 15.87,68.07
  Bottom 0.813: C25.1 15.88,55.75 v15.88,63.63
ANDR_ENABLE  (via drill 0.6)
  Top 0.305: 48.01,41.91 v44.7,39.62 | v38.1,38.86 31.5,38.86 30.99,38.35 30.99,37 Q2.C
  Top 0.406: Q2.C R17.1 | U$1.51 56.88,40.4 54.61,40.39 53.09,41.15 51.31,42.17 49.79,42.17 48.01,41.91
  Bottom 0.305: v44.7,39.62 38.86,39.62 v38.1,38.86
ANDROID_D+
  Top 0.406: C14.2 R15.2 57.53,14.63 JP4.D+
ANDROID_D-
  Top 0.406: C15.2 R14.2 55.37,14.63 JP4.D-
BATT_VOLT  (via drill 0.6)
  Top 0.305: R24.1 26.25,57.51 R25.2 26.24,64.34 31.75,69.85 41.15,69.85 41.66,69.34 41.91,69.34 42.42,68.83 43.18,68.83 43.43,68.58 43.43,60.71 v45.72,58.42 | v51.31,56.64 51.31,52.81 U$1.7
  Bottom 0.305: v45.72,58.42 49.78,58.42 v51.31,56.64
CAP_ON
  Top 0.305: U$1.21 42,47.5 21.59,47.5 21.34,47.24 21.34,23.62 19.56,21.84 U$11.PIN8
CAP_V_IN
  Top 0.305: R26.2 57.4,66.8 58.59,67.99 U$10.PIN12
CAP_VOLT
  Top 0.305: R26.1 R27.2 58.08,62.06 58.42,61.72 58.42,58.93 56.13,56.64 56.13,52.84 U$1.1
CRUISE_ON  (via drill 0.6)
  Top 0.305: v54.1,35.05 54.42,35.31 54.42,36.86 U$1.46 | 10.82,28.6 v10.92,28.7 10.31,28.09 U$11.PIN13 8.46,28.19 7.11,28.19 6.86,28.45 6.86,32.51 8.17,32.47 R21.1
  Bottom 0.305: v10.92,28.7 36.07,27.94 53.34,27.94 54.36,28.96 54.36,34.8 v54.1,35.05
DRIVE_CUR
  Top 0.305: U$1.2 55.12,52.78 55.12,57.4 56.39,58.67 56.39,67.06 57.34,67.76 U$10.PIN11
DRIVE_DISABLE
  Top 0.305: U$1.18 42.06,50.04 18.54,50.04 17.27,48.77 17.27,26.92 15.94,25.59 U$11.PIN11
DRIVE_ENABLE  (via drill 0.6)
  Top 0.305: v55.18,35.05 55.18,36.73 U$1.47 | v13.21,27.43 12.62,26.84 U$11.PIN12
  Bottom 0.305: v13.21,27.43 53.85,27.43 55.12,28.7 55.12,35.05 v55.18,35.05
DRIVE_ENABLE_IN
  Top 0.305: U$1.11 48.01,57.66 46.35,59.31 46.09,59.57 U$10.PIN2
DRIVE_V_IN
  Top 0.305: U$10.PIN9 54.84,65.39 R28.2
DRIVE_VOLT
  Top 0.305: R28.1 R29.2 54.44,62.06 53.85,61.47 53.85,56.64 53.59,56.39 U$1.4
EFI_IN
  Top 0.305: U$1.26 25.06,43.6 23.88,42.42 23.88,23.11 18.86,18.09 U$11.PIN5
GEN_CUR  (1 unrouted)
  Top 0.305: 55.84,69.05 55.88,66.29 55.88,58.93 54.36,57.4 54.36,52.75 U$1.3
GEN_START
  Top 0.305: U$1.19 41.92,49.02 19.3,49.02 18.29,48.01 18.29,26.16 16.47,24.34 U$11.PIN10
GEN_STOP
  Top 0.305: U$1.20 41.96,48.26 20.32,48.26 19.56,47.5 19.56,24.38 18.27,23.09 U$11.PIN9
GEN_TEMP
  Top 0.305: U$1.8 50.29,52.81 50.29,58.17 49.84,58.61 U$10.PIN5
GEN_V_IN
  Top 0.305: R30.2 52.32,67.31 53.59,68.58 U$10.PIN8
GEN_VOLT
  Top 0.305: R31.2 53,62.06 53.34,61.72 53.34,59.18 52.83,58.67 52.83,52.73 U$1.5
  Top 0.406: R31.2 R30.1
GND  (via drill 0.33, 0.5 pad 0.25, 0.6, 0.6 pad 0.25)  (1 unrouted)
  Top 0.305: U$1.14 45.6,54.92 C6.1 | 57.95,41.15 U$1.52 | U2.15 82.84,27.22 83.06,27.43
  Top 0.406: C14.1 62.9,19.39 62.99,18.54 | JP4.GND 62.12,14.63 62.99,15.49
  Top 0.813: 18.07,65.15 C7.1 | C7.1 20.12,65.15 VREG1.2 | U$3.2 20.21,64.98 C7.1 | R2.1 15.03,56.68 U$8.ON
  other vias: 13.72,6.86 68.83,66.29 74.3,42.42 44.45,57.02 9.02,57.66 11.94,66.04 13.21,66.04 13.21,64.77 24.13,67.31 52.07,59.18 54.86,59.18 57.4,59.18 59.94,58.93 63.75,70.1 63.75,68.33 34.04,44.96 49.91,44.7 51.56,35.05 84.45,60.71 84.2,56.13 56.2,46.35 62.04,37.27 47.18,39.37 45.09,33.02 44.96,29.91
  pour Top: -1,81 101,81 101,80 101,-1 -1,-1 -1,12
  pour Bottom: -2,82 102,82 102,-2 -2,-2
I2C_SCL
  Top 0.305: JP3.2 40.13,58.87 40.19,58.87 40.64,58.42 40.64,52.26 U$1.17
I2C_SDA
  Top 0.305: U$1.16 42.85,53.85 41.4,54.86 41.4,61.47 JP3.3
MC_ENABLE
  Top 0.305: U$1.23 42.07,45.97 23.62,45.97 23.11,45.47 23.11,23.37 19.09,19.34 U$11.PIN6
MC_ENABLE_IN
  Top 0.305: U$1.29 42.05,41.15 27.69,41.15 26.16,39.62 26.16,22.1 18.41,14.34 U$11.PIN2
MC_ON
  Top 0.305: U$1.22 42.03,46.74 22.61,46.74 22.35,46.48 22.35,23.62 19.32,20.59 U$11.PIN7
MC_ON_IN
  Top 0.305: U$1.28 42.01,41.91 26.92,41.91 25.4,40.39 25.4,22.35 18.64,15.59 U$11.PIN3
MEGASQUIRT_RX
  Top 0.305: U$1.48 56.02,35.44 58.23,32.64 60.77,28.83 72.52,28.89 73.66,27.94 78.74,22.86 80.26,22.86 80.77,23.37 80.77,25.74 U2.12
MEGASQUIRT_TX
  Top 0.305: U$1.49 70.42,38.8 74.68,34.54 74.68,28.19 78.99,23.88 80.01,23.88 80.26,24.13 80.26,25.84 U2.11
MOTOR_TEMP
  Top 0.305: U$1.9 49.53,52.77 49.53,57.91 48.59,58.85 U$10.PIN4
N$1
  Top 0.406: C1.2 63.45,44.52 Y1.P$2 62.12,44.3 60.45,45.97 57.93,45.97 U$1.58
N$2
  Top 0.406: C2.2 63.33,47.91 Y1.P$1 61.47,48 60.2,46.74 57.97,46.74 U$1.59
N$3  (via drill 0.6)
  other vias: 17.27,66.29
N$8
  Top 0.305: C22.1 46.99,27.18 IC1.4
N$9
  Top 0.305: C23.1 44.2,24.89 45.72,26.42 46.95,26.42 IC1.5
N$10
  Top 0.813: U$8.ISET 11.64,58.29 R2.2
N$11
  Top 0.305: R11.1 50.34,21.38 50.8,21.84 50.8,22.57 IC1.12
N$12
  Top 0.305: C22.2 39.19,27.18 Y3.P$2
N$13
  Top 0.305: C23.2 38.43,24.89 Y3.P$1
N$15  (via drill 0.6)
  Top 0.406: IC1.18 56.51,24.77 v57.66,23.62 | v55.37,21.59 R14.1
  Bottom 0.406: v57.66,23.62 57.4,23.62 v55.37,21.59
N$18
  Top 0.305: C17.2 84.23,32.9 U2.1
N$19
  Top 0.406: R15.1 57.53,21.64 IC1.17
N$20
  Top 0.305: IC1.3 48.23,27.97 48.51,27.69 48.51,25.15 48.01,24.64 47.13,24.64 IC1.7 45.87,24.77 C16.2
N$23
  Top 0.406: R18.2 32.62,35.14 Q2.B
N$24
  Top 0.406: C13.2 L1.1 49.93,14.63 JP4.VBUS
N$25
  Top 0.305: U2.3 82.19,33.43 82.8,34.04 84.46,34.04 C17.1
N$26
  Top 0.305: C18.2 82.9,34.89 81.53,33.53 U2.4
N$27
  Top 0.305: U2.5 80.89,34.67 C18.1
N$28
  Top 0.305: C21.2 79.34,34.46 80.26,33.53 80.26,32.18 U2.6
N$29
  Top 0.406: U2.2 82.84,30.14 82.68,29.97 76.22,29.97 C20.2
N$30
  Top 0.406: USB_ER.A R12.2
N$31
  Top 0.254: R19.2 12V_LED.A
N$33
  Top 0.305: CRUISE.A R21.2
N$35
  Top 0.305: R20.2 STATUS.A
OUT_SQRT_RD
  Top 0.305: U2.13 81.54,28.46 81.79,28.7 86.54,28.7 X1.4
OUT_SQRT_TD
  Top 0.305: U2.14 82.19,27.33 82.8,27.94 88.55,27.94 X1.3
PDI_CLK  (via drill 0.6)
  Top 0.254: R13.2 64.33,55.69 v63.5,54.86
  Top 0.305: v63.5,54.86 60.45,51.82 60.45,48.26 v59.94,47.75 | v59.94,44.96 59.69,45.21 57.91,45.21 U$1.57
  Bottom 0.305: JP1.5 65.39,56.75 v63.5,54.86 | v59.94,47.75 v59.94,44.96
PDI_DATA  (via drill 0.6)
  Top 0.305: JP1.1 66.4,61.83 65.53,60.96 65.53,55.63 v61.47,51.31 | v60.71,43.94 59.69,43.94 59.18,44.45 57.95,44.45 U$1.56
  Bottom 0.305: v61.47,51.31 61.21,44.45 v60.71,43.94
PITOT
  Top 0.305: U$1.6 52.07,52.77 52.32,57.4 50.8,58.93 50.8,67.06 52.07,68.33 52.34,68.6 U$10.PIN7
REGEN_POS
  Top 0.305: U$10.PIN13 59.84,65.57 R34.2
REGEN_POS_MC
  Top 0.305: R34.1 R35.2 59.28,62.07 58.93,61.72 58.93,51.05 58.67,50.8 U$1.64
SD_CS  (via drill 0.6)
  Top 0.406: U$1.50 78.46,39.6 v87.12,48.26 | v90.93,53.34 92.22,53.34 U$2.2
  Bottom 0.406: v87.12,48.26 87.12,49.53 v90.93,53.34
SD_DETECT  (via drill 0.6)
  Top 0.305: v49.78,40.89 49.53,40.64 49.53,36.97 U$1.40 | U$2.CD1 79.2,47.54 v73.34,52.39
  Bottom 0.305: v73.34,52.39 72.33,51.37 62.42,41.66 50.55,41.66 v49.78,40.89
SD_MISO  (via drill 0.6)
  Top 0.305: U$2.7 92.66,48.01 89.41,48.01 87.88,49.53 80.77,49.53 77.47,52.83 v76.71,52.83 | U$1.42 51.2,39.01 v52.07,39.88 | v69.85,42.42 68.83,43.43 v68.83,44.96
  Bottom 0.305: v52.07,39.88 63.75,39.88 v68.83,44.96 v76.71,52.83 | SPI.2 65.66,35.88 66.74,37.59 69.85,41.4 v69.85,42.42
SD_MOSI  (via drill 0.6)
  Top 0.254: v88.27,54.99 89.53,54.99 89.66,55.12
  Top 0.305: R9.2 90.05,59.48 89.92,59.48 89.66,59.23 89.66,55.12 89.66,53.09 90.41,52.34 U$2.3 | v50.55,39.62 50.29,37.01 U$1.41 | v70.87,43.94 69.98,44.83 v69.98,47.62
  Bottom 0.305: v88.27,54.99 78.49,55.05 76.83,54.55 74.42,52.07 v69.98,47.62 63.25,40.89 51.82,40.89 v50.55,39.62 | SPI.3 68.2,36.39 70.29,39.43 70.87,41.4 v70.87,43.94
SD_SCK  (via drill 0.6)
  Top 0.305: U$2.5 81.17,50.14 79.76,51.56 v79.76,51.82 | U$1.43 52,38.03 v52.83,38.86
  Bottom 0.305: v52.83,38.86 64.52,39.12 72.01,46.61 | 72.01,46.61 77.22,51.82 v79.76,51.82 | SPI.4 70.8,36.7 72.14,41.66 72.14,46.48 72.01,46.61
SPARE2  (via drill 0.6)
  Top 0.305: U$1.54 65.4,42.8 v68.58,41.66 | v62.99,35.62 SPI.1
  Bottom 0.305: v68.58,41.66 65.09,37.78 v62.99,35.62
SPEED
  Top 0.305: U$1.10 48.77,52.73 48.77,57.91 47.34,59.34 U$10.PIN3
STARTING_IN
  Top 0.305: U$1.27 41.97,42.67 25.91,42.67 24.64,41.4 24.64,22.86 18.62,16.84 U$11.PIN4
STATUS_LED
  Top 0.305: U$1.30 37.35,40.4 36.83,39.88 35.55,39.88 R20.1
THROTTLE_POS
  Top 0.305: R32.2 61.09,66.76 U$10.PIN14
THRT_POS_MC
  Top 0.305: R32.1 R33.2 61.3,62.06 60.96,61.72 60.96,57.91 59.44,56.39 59.44,50.29 59.18,50.04 57.94,50.04 U$1.63
USB_CTS#  (via drill 0.6)
  Top 0.305: U$1.37 47.2,34.33 v47.5,34.04 | v53.09,29.21 53.09,30.85 IC1.26
  Bottom 0.305: v47.5,34.04 v53.09,29.21
USB_D+
  Top 0.305: U$1.33 42.66,35.56 41.15,35.56 24.42,16.54 20.54,12.67 DEBUG.D+
USB_D-
  Top 0.305: U$1.32 40.64,37.34 40.64,36.07 23.44,16.84 19.74,13.14 DEBUG.D-
USB_ERROR  (via drill 0.6)
  Top 0.305: R18.1 32.48,32.38 USB_ER.C 33.34,31.94 v33.53,31.75 | v40.64,30.99 48.18,30.99 IC1.32
  Top 0.406: R16.1 30.92,34.54 R18.1
  Bottom 0.305: v33.53,31.75 36.07,31.75 38.1,29.72 39.37,29.72 v40.64,30.99
USB_RTS#
  Top 0.305: IC1.25 53.9,32.71 53.59,33.02 46.99,33.02 46.23,33.78 46.23,36.73 U$1.36
USB_RX
  Top 0.305: U$1.38 48,35.31 49.53,33.53 55.37,33.53 57.15,32 57.15,29.72 56.9,29.46 55.3,29.46 IC1.24
USB_TX
  Top 0.305: U$1.39 48.8,35.53 49.78,34.04 55.63,34.04 57.66,32.26 57.66,29.46 56.9,28.7 55.27,28.7 IC1.23
USB_TX_ACTIVE  (via drill 0.6)
  Top 0.305: U$1.31 40.87,39.6 v39.62,38.35 | v41.66,32 50.55,32 50.8,31.75 50.8,30.97 IC1.29
  Bottom 0.305: v39.62,38.35 39.62,34.04 v41.66,32
V_BATT  (via drill 0.6)
  Top 0.305: R24.2 23.37,59.69 22.99,60.07 22.86,60.2 | U$10.PIN6 51.09,70.17 50.93,70.33
  Top 0.406: U$8.VOUT 22.23,60.83 22.73,60.33 | 22.73,60.33 22.86,60.2 | 51.09,69.81 51.05,69.85 50.93,70.33 50.8,70.87 50.04,71.37 v49.28,71.63 | v43.18,70.61 31.5,70.61 25.65,64.77 25.65,61.21 25.4,60.96 23.37,60.96 22.73,60.33 | R19.1 24.15,53.85 22.99,53.85
  Top 0.61: 22.99,60.07 22.99,53.85 22.99,53.47 22.86,53.34 22.35,53.09 JP2.1
  Top 0.813: IC2.IN 9.4,39.62 C24.1 12.45,39.62 16,43.18 16,48.77 18.29,51.05 20.07,51.05 20.32,51.31 JP2.1
  Bottom 0.406: v49.28,71.63 v43.18,70.61
V_BATT_IN
  Top 0.813: 12V.2 10.16,62.37 10.16,62.48 13.72,62.48 U$8.VIN 17.14,60.83 17.78,60.2 JP2.2

### Text on the board
tPlace: CONN1 | R1 | GND | C8 | R30 | R28 | R26 | R34 | R32 | PDI | C9 | C10 | R9 | SPI | DigiPot | C7 | R2 | R24 | R33 | R31 | R29 | R27 | R35 | 12V+ | R25 | C6 | R13 | R19 | 12V | C25 | C2 | C4 | C1 | C24 | C3 | R17 | C21 | C18 | C17 | C5 | R21 | R16 | R18 | CRUISE | R12 | USB ER | 12MHz | MAX232 | C22 | TWI | C20 | C12 | C11 | C23 | C19 | C16 | C15 | R14 | R15 | C14 | R11 | C13 | L1 | MEGASQUIRT | CONN2 | Designed by: Tyler Dicks 2014 | DEBUG | ANDROID